# Altium project Modulo_de_apertura.PrjPcb
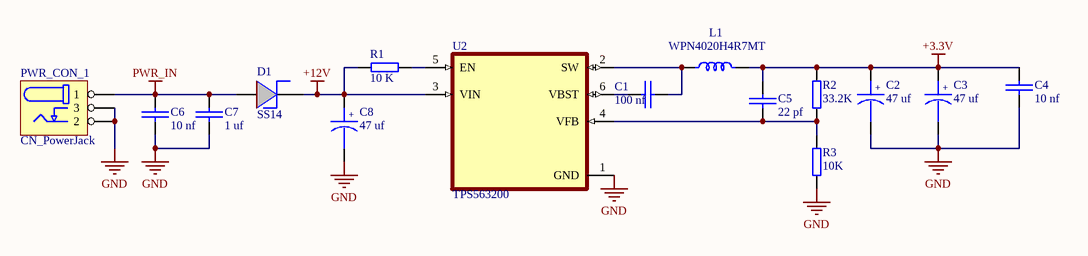
[diagram p0: MdA_Power.SchDoc]
CAGE_CODE: ?????; CONTRACT_NUMBER: <CONTRACT NO>; DOC_NO_ASSY_DWG: <ASSY DWG NO>; DOC_NO_BOM: <BOM DOC NO>; DOC_NO_FAB_DWG: <FAB DWG NO>; DOC_NO_SCH_DWG: <SCH DWG NO>; PCB_2_DEC_TOL: +/-.01; PCB_3_DEC_TOL: +/-.010; PCB_ANG_TOL: +/-1/2; PCB_ASSEMBLY_NO: <PCB ASSY NO>; PCB_CHECKER: - -----; PCB_CHECKER_APP_DATE: --/--/----; PCB_DESIGNER: - -----; PCB_DESIGNER_APP_DATE: --/--/----; PCB_DWG_NO: <PCB DWG NO>; PCB_ENGINEER: - -----; PCB_ENGINEER_APP_DATE: --/--/----; PCB_PART_NUMBER: <PCB PN>; PCB_REV: A; SCH_REV: A
4 sheets, 74 parts. Net scope: global (net labels, ports and power ports of the same name join across sheets).
Board file: PCB1.PcbDoc
Sheets:
  MdA_Power.SchDoc
  MdA_RS485.SchDoc
  MdA_Perifericos.SchDoc
  MdA_CPU.SchDoc

## Sheet MdA_Power.SchDoc: **
size A4; ENG_APP_DATE: --/--/--; DSN_APP_DATE: --/--/--; CHK_APP_DATE: --/--/--; Author: **; CompanyName: Introducción al Diseño de Circuitos Impresos; Organization: UTN FRBA; Revision: **; SheetNumber: 1; SheetTotal: 4

### Parts
C1  100 nf  [C_0402]
C2  47 uf  [C_P_1210]
C3  47 uf  [C_P_1210]
C4  10 nf  [C_0603]
C5  22 pf  [C_0402]
C6  10 nf  [C_0402]
C7  1 uf  [C_0603]
C8  47 uf  [C_P_1210]
D1  SS14  [D_SMA]
L1  WPN4020H4R7MT  [IFSC1515AH]
PWR_CON_1  CN_PowerJack  [PJ002B]
R1  10 K  [R_0402]
R2  33.2K  [R_0402]
R3  10K  [R_0402]
U2  TPS563200  [SOT-23-6]

### Nets
+3.3V: C2.1 C3.1 C4.2 C5.1 L1.2 R2.2
+12V: C8.1 D1.2(K) R1.2 U2.3(VIN)
GND: C2.2 C3.2 C4.1 C6.2 C7.2 C8.2 PWR_CON_1.2 PWR_CON_1.3 R3.1 U2.1(GND)
PWR_IN: C6.1 C7.1 D1.1(A) PWR_CON_1.1
NetC1_1: C1.1 U2.6(VBST)
NetC1_2: C1.2 L1.1 U2.2(SW)
NetC5_2: C5.2 R2.1 R3.2 U2.4(VFB)
NetR1_1: R1.1 U2.5(EN)

### Notes on the sheet
- Title:
- Size:
- Author:
- A4
- Sheet
- of
- Revision:
- File:
- Date:
- (in symbol CAP_P) +

### Library data of the parts
C1 C4-C7 = CAP
  C6: LCSC PArt Number: *
C2 C3 C8 = CAP_P
D1 = DIODE_SH
L1 = IND
R1-R3 = RES

## Sheet MdA_RS485.SchDoc: **
size A4; Author: **; CompanyName: Introducción al Diseño de Circuitos Impresos; Organization: UTN FRBA; Revision: **; SheetNumber: 2; SheetTotal: 4
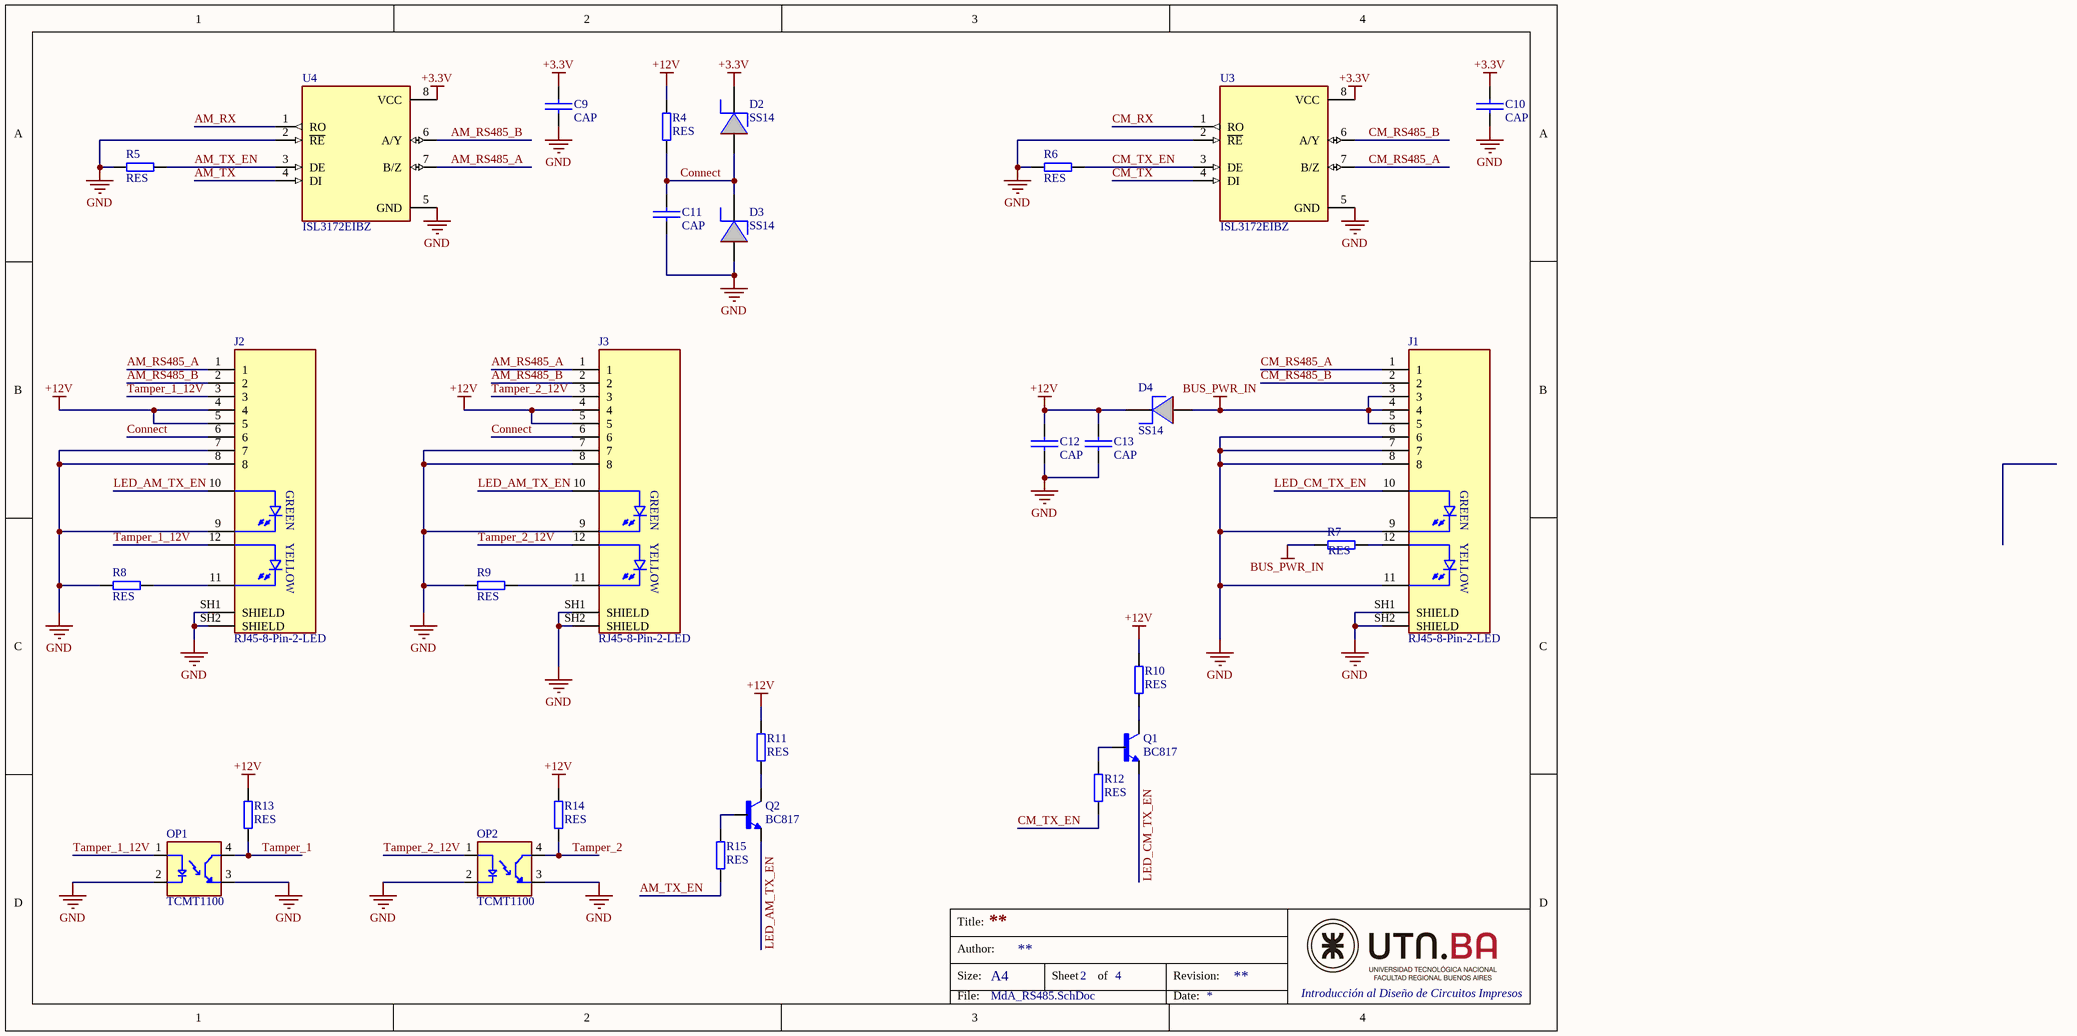
[diagram p1: MdA_RS485.SchDoc]

### Parts
C9  CAP  [C_0402]
C10  CAP  [C_0402]
C11  CAP  [C_0402]
C12  CAP  [C_0402]
C13  CAP  [C_0603]
D2  SS14  [D_SMA]
D3  SS14  [D_SMA]
D4  SS14  [D_SMA]
J1  RJ45-8-Pin-2-LED  [RJ45-8-Pin-2-Led]
J2  RJ45-8-Pin-2-LED  [RJ45-8-Pin-2-Led]
J3  RJ45-8-Pin-2-LED  [RJ45-8-Pin-2-Led]
OP1  TCMT1100  [SSOP4]
OP2  TCMT1100  [SSOP4]
Q1  BC817  [SOT-23-3]
Q2  BC817  [SOT-23-3]
R4  RES  [R_0402]
R5  RES  [R_0402]
R6  RES  [R_0402]
R7  RES  [R_0402]
R8  RES  [R_0402]
R9  RES  [R_0402]
R10  RES  [R_0402]
R11  RES  [R_0402]
R12  RES  [R_0402]
R13  RES  [R_0402]
R14  RES  [R_0402]
R15  RES  [R_0402]
U3  ISL3172EIBZ  [SOIC-8]
U4  ISL3172EIBZ  [SOIC-8]

### Nets
+3.3V: C9.1 C10.1 D2.2(K) U3.8(VCC) U4.8(VCC)
+12V: C12.1 C13.1 D4.2(K) J2.4 J2.5 J3.4 J3.5 R4.1 R10.1 R11.1 R13.1 R14.1
BUS_PWR_IN: D4.1(A) J1.3 J1.4 J1.5 R7.2
GND: C9.2 C10.2 C11.2 C12.2 C13.2 D3.1(A) J1.6 J1.7 J1.8 J1.9 J1.11 J1.SH1(SHIELD) J1.SH2(SHIELD) J2.7 J2.8 J2.9 J2.SH1(SHIELD) J2.SH2(SHIELD) J3.7 J3.8 J3.9 J3.SH1(SHIELD) J3.SH2(SHIELD) OP1.2(C) OP1.3(ET) OP2.2(C) OP2.3(ET) R5.2 R6.2 R8.2 R9.2 U3.2(~{RE}) U3.5(GND) U4.2(~{RE}) U4.5(GND)
AM_RS485_A: J2.1 J3.1 U4.7(B/Z)
AM_RS485_B: J2.2 J3.2 U4.6(A/Y)
AM_RX: U4.1(RO)
AM_TX: U4.4(DI)
AM_TX_EN: R5.1 R15.2 U4.3(DE)
CM_RS485_A: J1.1 U3.7(B/Z)
CM_RS485_B: J1.2 U3.6(A/Y)
CM_RX: U3.1(RO)
CM_TX: U3.4(DI)
CM_TX_EN: R6.1 R12.2 U3.3(DE)
Connect: C11.1 D2.1(A) D3.2(K) J2.6 J3.6 R4.2
LED_AM_TX_EN: J2.10 J3.10 Q2.2(E)
LED_CM_TX_EN: J1.10 Q1.2(E)
Tamper_1: OP1.4(CT) R13.2
Tamper_1_12V: J2.3 J2.12 OP1.1(A)
Tamper_2: OP2.4(CT) R14.2
Tamper_2_12V: J3.3 J3.12 OP2.1(A)
NetJ1_12: J1.12 R7.1
NetJ2_11: J2.11 R8.1
NetJ3_11: J3.11 R9.1
NetQ1_1: Q1.1(B) R12.1
NetQ1_3: Q1.3(C) R10.2
NetQ2_1: Q2.1(B) R15.1
NetQ2_3: Q2.3(C) R11.2

### Notes on the sheet
- Title:
- Size:
- Author:
- A4
- Sheet
- of
- Revision:
- File:
- Date:
- (in symbol RJ45-8-Pin-2-LED) GREEN; YELLOW

### Library data of the parts
D2-D4 = DIODE_SH
U3 U4 = ISL3172EIBZ: Transceiver Half RS422, RS485 8-SOIC

## Sheet MdA_Perifericos.SchDoc: **
size A4; Author: **; CompanyName: Introducción al Diseño de Circuitos Impresos; Organization: UTN FRBA; Revision: **; SheetNumber: 3; SheetTotal: 4
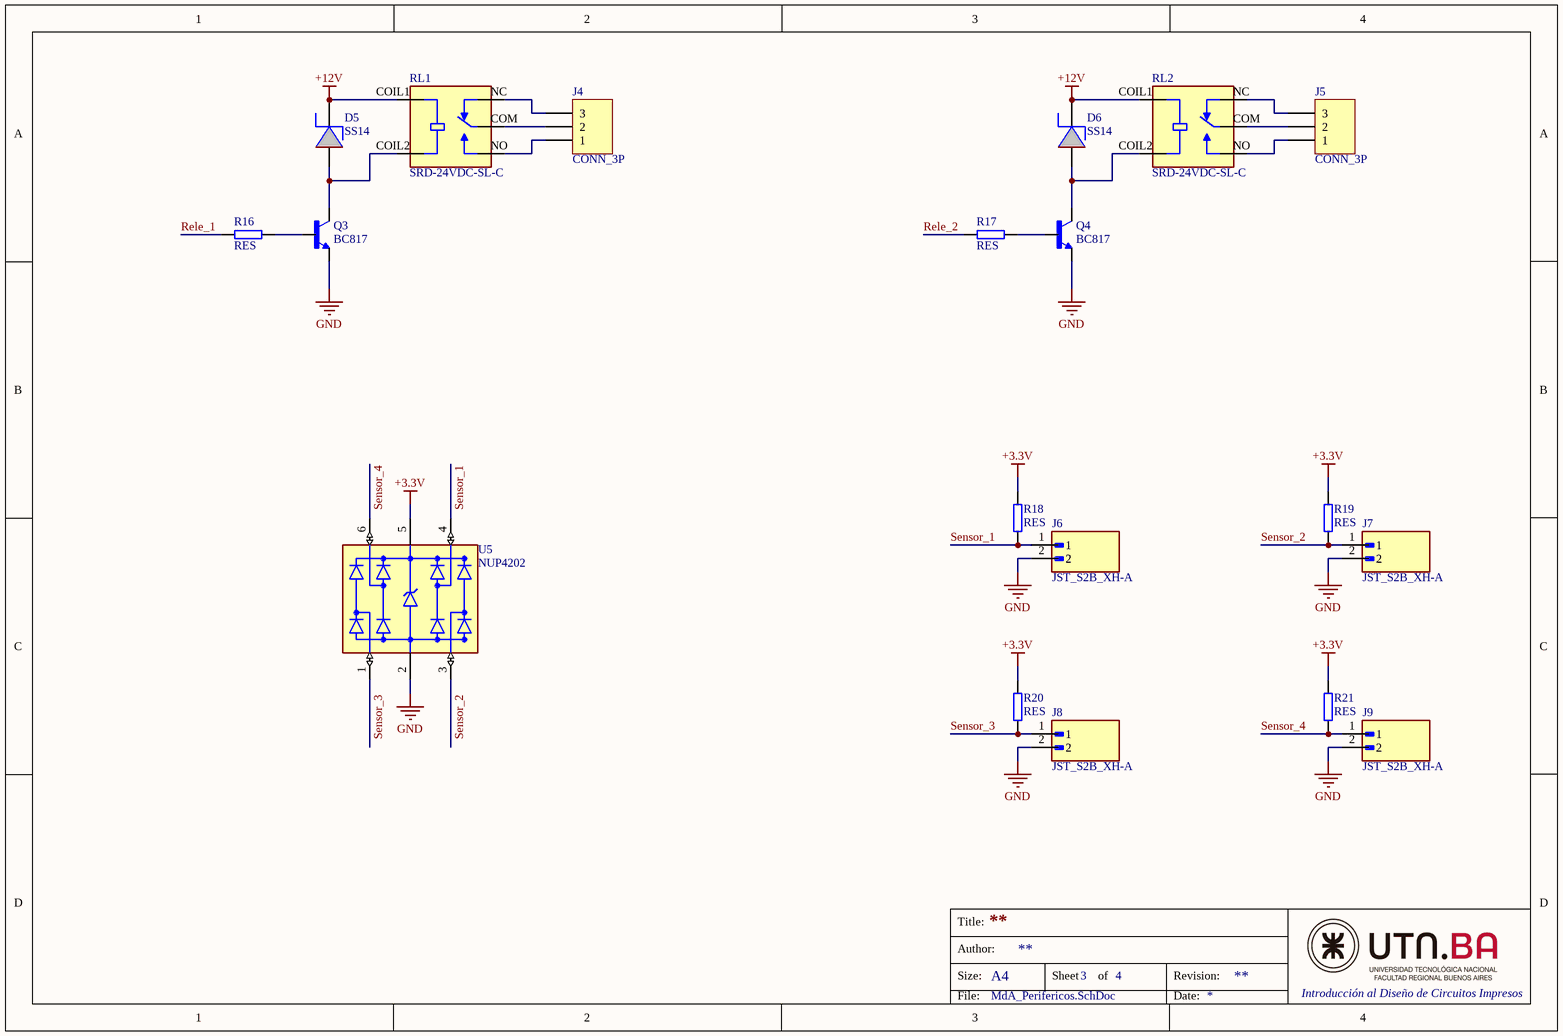
[diagram p2: MdA_Perifericos.SchDoc]

### Parts
D5  SS14  [D_SMA]
D6  SS14  [D_SMA]
J4  CONN_3P  [BORNERA_3P_P_5mm]
J5  CONN_3P  [BORNERA_3P_P_5mm]
J6  JST_S2B_XH-A  [JST_S2B-XH-A]
J7  JST_S2B_XH-A  [JST_S2B-XH-A]
J8  JST_S2B_XH-A  [JST_S2B-XH-A]
J9  JST_S2B_XH-A  [JST_S2B-XH-A]
Q3  BC817  [SOT-23-3]
Q4  BC817  [SOT-23-3]
R16  RES  [R_0402]
R17  RES  [R_0402]
R18  RES  [R_0402]
R19  RES  [R_0402]
R20  RES  [R_0402]
R21  RES  [R_0402]
RL1  SRD-24VDC-SL-C  [RELAY_SRD-24VDC-SL-C]
RL2  SRD-24VDC-SL-C  [RELAY_SRD-24VDC-SL-C]
U5  NUP4202  [SOT-363]

### Nets
+3.3V: R18.1 R19.1 R20.1 R21.1 U5.5(VDD)
+12V: D5.2(K) D6.2(K) RL1.COIL1 RL2.COIL1
GND: J6.2 J7.2 J8.2 J9.2 Q3.2(E) Q4.2(E) U5.2(GND)
Rele_1: R16.1
Rele_2: R17.1
Sensor_1: J6.1 R18.2 U5.4(IO3)
Sensor_2: J7.1 R19.2 U5.3(IO2)
Sensor_3: J8.1 R20.2 U5.1(IO1)
Sensor_4: J9.1 R21.2 U5.6(IO4)
NetD5_1: D5.1(A) Q3.3(C) RL1.COIL2
NetD6_1: D6.1(A) Q4.3(C) RL2.COIL2
NetJ4_1: J4.1 RL1.NO
NetJ4_2: J4.2 RL1.COM
NetJ4_3: J4.3 RL1.NC
NetJ5_1: J5.1 RL2.NO
NetJ5_2: J5.2 RL2.COM
NetJ5_3: J5.3 RL2.NC
NetQ3_1: Q3.1(B) R16.2
NetQ4_1: Q4.1(B) R17.2

### Notes on the sheet
- Title:
- Size:
- Author:
- A4
- Sheet
- of
- Revision:
- File:
- Date:

### Library data of the parts
D5 D6 = DIODE_SH

## Sheet MdA_CPU.SchDoc: **
size A4; Author: **; CompanyName: Introducción al Diseño de Circuitos Impresos; Organization: UTN FRBA; Revision: **; SheetNumber: 4; SheetTotal: 4
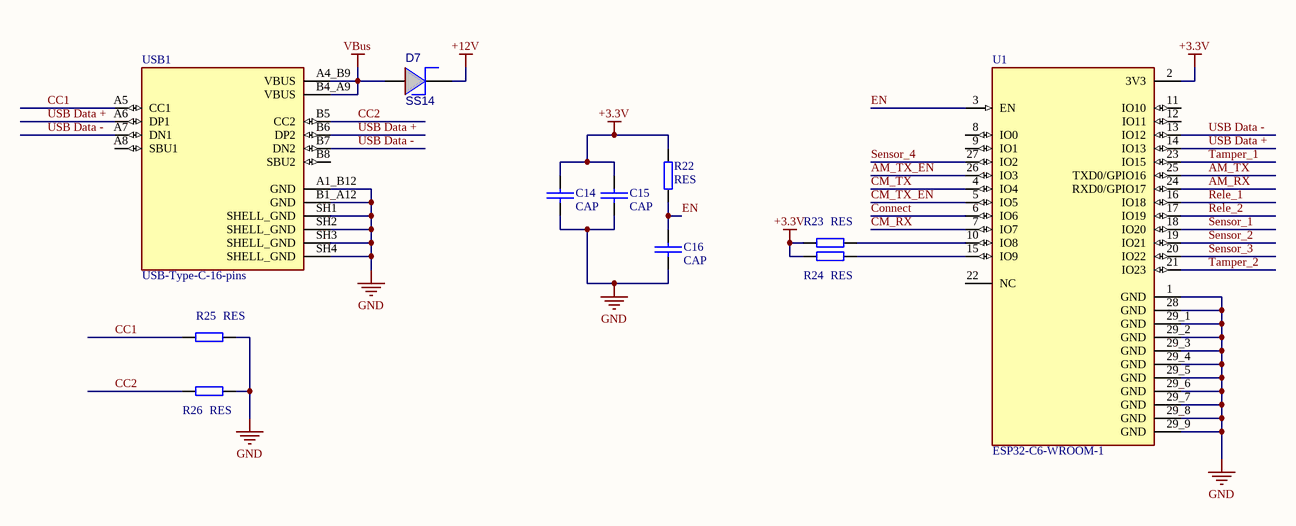
[diagram p3: MdA_CPU.SchDoc]

### Parts
C14  CAP  [C_0402]
C15  CAP  [C_0402]
C16  CAP  [C_0402]
D7  SS14  [D_SMA]
R22  RES  [R_0402]
R23  RES  [R_0402]
R24  RES  [R_0402]
R25  RES  [R_0402]
R26  RES  [R_0402]
U1  ESP32-C6-WROOM-1  [ESP32-C6-WROOM-1]
USB1  USB-Type-C-16-pins  [GCT_USB4105GFA120]

### Nets
+3.3V: C14.1 C15.1 R22.1 R23.2 R24.2 U1.2(3V3)
+12V: D7.2(K)
GND: C14.2 C15.2 C16.2 R25.1 R26.1 U1.1(GND) U1.28(GND) U1.29_1(GND) U1.29_2(GND) U1.29_3(GND) U1.29_4(GND) U1.29_5(GND) U1.29_6(GND) U1.29_7(GND) U1.29_8(GND) U1.29_9(GND) USB1.A1_B12(GND) USB1.B1_A12(GND) USB1.SH1(SHELL_GND) USB1.SH2(SHELL_GND) USB1.SH3(SHELL_GND) USB1.SH4(SHELL_GND)
VBus: D7.1(A) USB1.A4_B9(VBUS) USB1.B4_A9(VBUS)
AM_RX: U1.24(RXD0/GPIO17)
AM_TX: U1.25(TXD0/GPIO16)
AM_TX_EN: U1.26(IO3)
CC1: R25.2 USB1.A5(CC1)
CC2: R26.2 USB1.B5(CC2)
CM_RX: U1.7(IO7)
CM_TX: U1.4(IO4)
CM_TX_EN: U1.5(IO5)
Connect: U1.6(IO6)
EN: C16.1 R22.2 U1.3(EN)
Rele_1: U1.16(IO18)
Rele_2: U1.17(IO19)
Sensor_1: U1.18(IO20)
Sensor_2: U1.19(IO21)
Sensor_3: U1.20(IO22)
Sensor_4: U1.27(IO2)
Tamper_1: U1.23(IO15)
Tamper_2: U1.21(IO23)
USB Data +: U1.14(IO13) USB1.A6(DP1) USB1.B6(DP2)
USB Data -: U1.13(IO12) USB1.A7(DN1) USB1.B7(DN2)
NetR23_1: R23.1 U1.10(IO8)
NetR24_1: R24.1 U1.15(IO9)

Not connected (* = marked no-connect by the designer): U1 8(IO0) 9(IO1) 11(IO10) 12(IO11) 22(NC); USB1 A8(SBU1) B8(SBU2)

### Notes on the sheet
- Title:
- Size:
- Author:
- A4
- Sheet
- of
- Revision:
- File:
- Date:

### Library data of the parts
D7 = DIODO_SH: Diode Shottky

## Nets that join several sheets
+3.3V: MdA_Power (6 pins), MdA_RS485 (5 pins), MdA_Perifericos (5 pins), MdA_CPU (6 pins)
+12V: MdA_Power (C8.1 D1.2 R1.2 U2.3), MdA_RS485 (12 pins), MdA_Perifericos (D5.2 D6.2 RL1.COIL1 RL2.COIL1), MdA_CPU (D7.2)
GND: MdA_Power (10 pins), MdA_RS485 (35 pins), MdA_Perifericos (7 pins), MdA_CPU (22 pins)
AM_RX: MdA_RS485 (U4.1), MdA_CPU (U1.24)
AM_TX: MdA_RS485 (U4.4), MdA_CPU (U1.25)
AM_TX_EN: MdA_RS485 (R5.1 R15.2 U4.3), MdA_CPU (U1.26)
CM_RX: MdA_RS485 (U3.1), MdA_CPU (U1.7)
CM_TX: MdA_RS485 (U3.4), MdA_CPU (U1.4)
CM_TX_EN: MdA_RS485 (R6.1 R12.2 U3.3), MdA_CPU (U1.5)
Connect: MdA_RS485 (6 pins), MdA_CPU (U1.6)
Rele_1: MdA_Perifericos (R16.1), MdA_CPU (U1.16)
Rele_2: MdA_Perifericos (R17.1), MdA_CPU (U1.17)
Sensor_1: MdA_Perifericos (J6.1 R18.2 U5.4), MdA_CPU (U1.18)
Sensor_2: MdA_Perifericos (J7.1 R19.2 U5.3), MdA_CPU (U1.19)
Sensor_3: MdA_Perifericos (J8.1 R20.2 U5.1), MdA_CPU (U1.20)
Sensor_4: MdA_Perifericos (J9.1 R21.2 U5.6), MdA_CPU (U1.27)
Tamper_1: MdA_RS485 (OP1.4 R13.2), MdA_CPU (U1.23)
Tamper_2: MdA_RS485 (OP2.4 R14.2), MdA_CPU (U1.21)